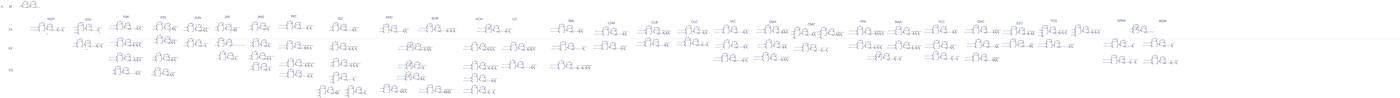
[diagram p0: schematic micro_instructions.asc, whole sheet]
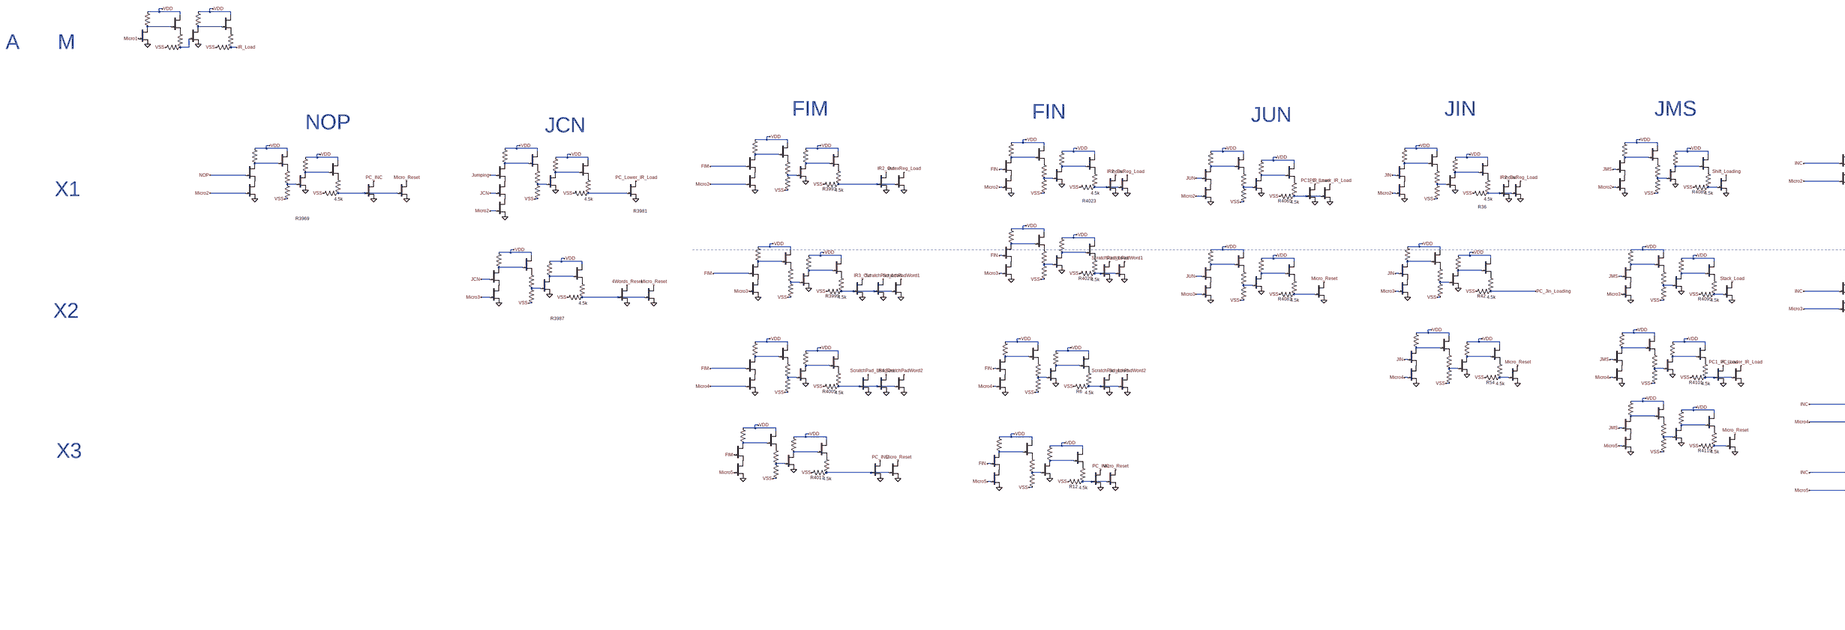
[diagram p1: schematic micro_instructions.asc, part, row 1 of 1, column 1 of 5]
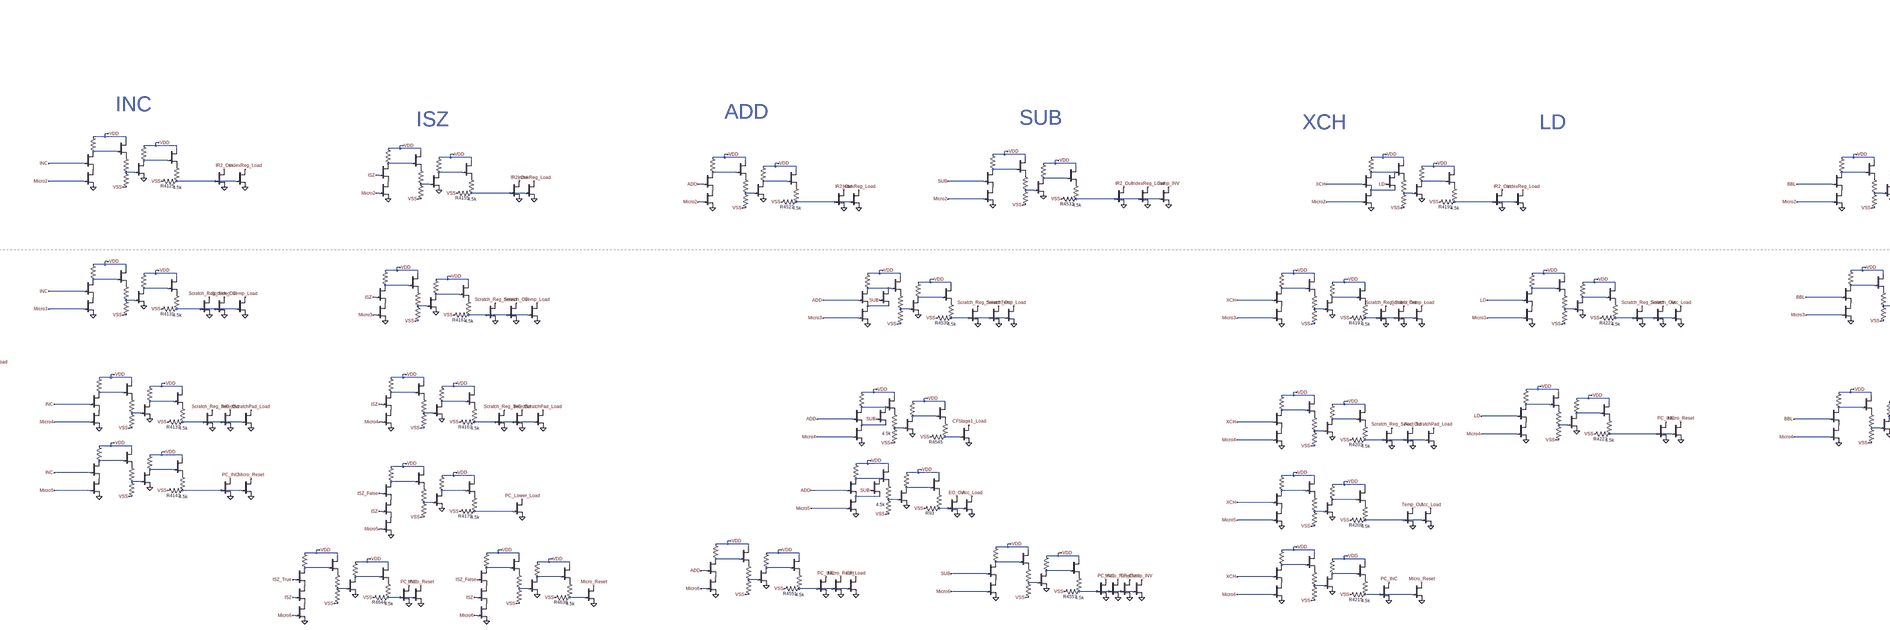
[diagram p2: schematic micro_instructions.asc, part, row 1 of 1, column 2 of 5]
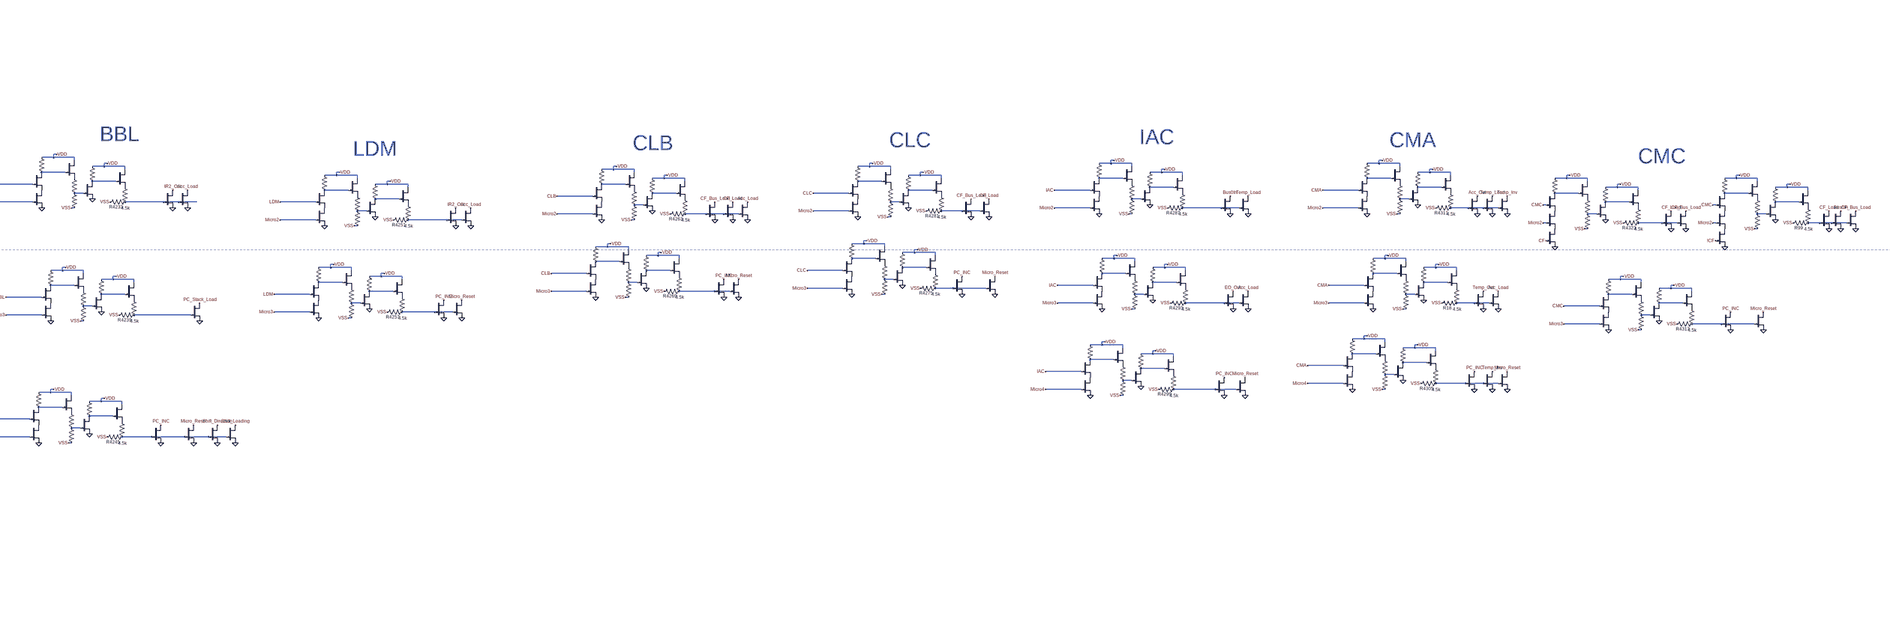
[diagram p3: schematic micro_instructions.asc, part, row 1 of 1, column 3 of 5]
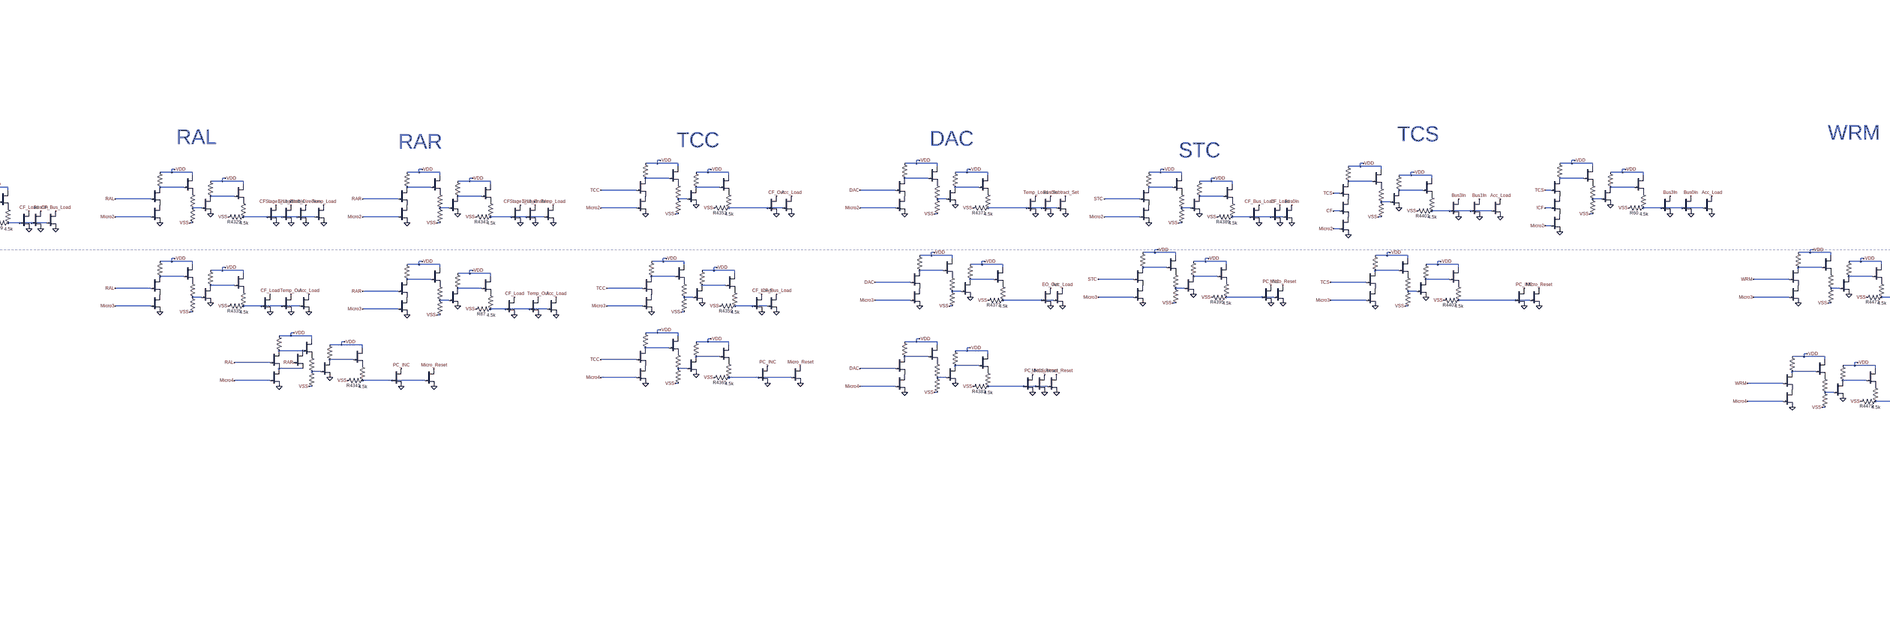
[diagram p4: schematic micro_instructions.asc, part, row 1 of 1, column 4 of 5]
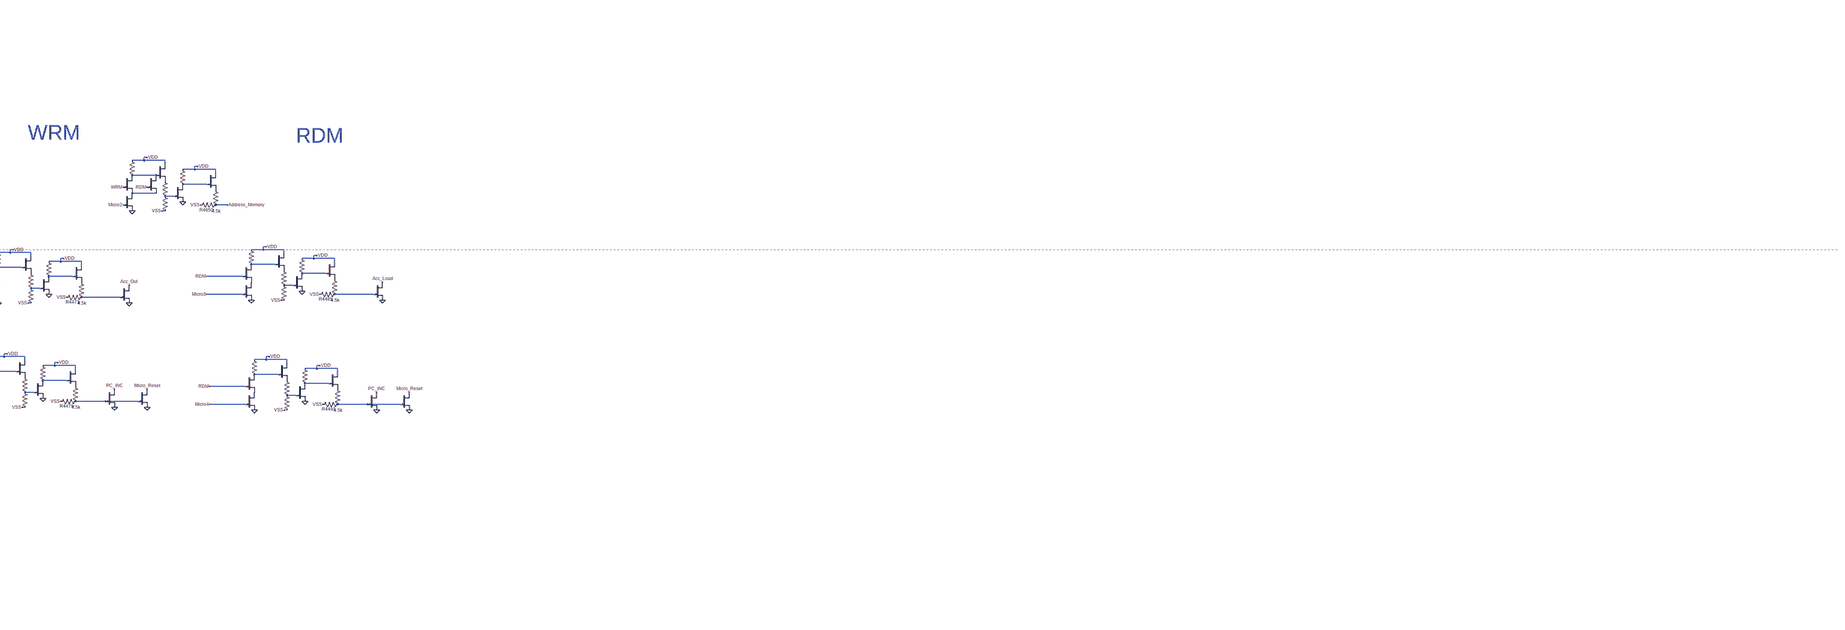
[diagram p5: schematic micro_instructions.asc, part, row 1 of 1, column 5 of 5]
* micro_instructions.asc
J_A2433 N009 NOP P001 DR
R3964 VDD N009 100k
J_F1003 VDD N009 P002 DR
R3965 P002 N043 1k
R3966 N043 VSS 4.8k
J_B1138 P001 Micro2 0 DR
J_A2434 N018 N043 0 DR
R3967 VDD N018 50k
J_F1004 VDD N018 P003 DR
R3968 P003 N066 1k
R3969 N066 VSS 4.5k
J_Input29 PC_INC N066 0 DR
J_Input30 Micro_Reset N066 0 DR
J_A2437 P004 JCN P005 DR
R3976 VDD N010 100k
J_F1007 VDD N010 P006 DR
R3977 P006 N044 1k
R3978 N044 VSS 4.8k
J_B1140 P005 Micro2 0 DR
J_A2438 N019 N044 0 DR
R3979 VDD N019 50k
J_F1008 VDD N019 P007 DR
R3980 P007 N067 1k
R3981 N067 VSS 4.5k
J_Input33 PC_Lower_IR_Load N067 0 DR
J_A2439 N127 JCN P008 DR
R3982 VDD N127 100k
J_F1009 VDD N127 P009 DR
R3983 P009 N165 1k
R3984 N165 VSS 4.8k
J_B1141 P008 Micro3 0 DR
J_A2440 N142 N165 0 DR
R3985 VDD N142 50k
J_F1010 VDD N142 P010 DR
R3986 P010 N187 1k
R3987 N187 VSS 4.5k
J_Input35 Micro_Reset N187 0 DR
J_A2441 N010 Jumping P004 DR
J_A2443 N005 FIM P011 DR
R3988 VDD N005 100k
J_F1011 VDD N005 P012 DR
R3989 P012 N026 1k
R3990 N026 VSS 4.8k
J_B1142 P011 Micro2 0 DR
J_A2444 N011 N026 0 DR
R3991 VDD N011 50k
J_F1012 VDD N011 P013 DR
R3992 P013 N045 1k
R3993 N045 VSS 4.5k
J_Input36 IR2_Out N045 0 DR
J_Input38 IndexReg_Load N045 0 DR
J_A2445 N120 FIM P014 DR
R3994 VDD N120 100k
J_F1013 VDD N120 P015 DR
R3995 P015 N152 1k
R3996 N152 VSS 4.8k
J_A2446 N131 N152 0 DR
R3997 VDD N131 50k
J_F1014 VDD N131 P016 DR
R3998 P016 N174 1k
R3999 N174 VSS 4.5k
J_Input39 IR3_Out N174 0 DR
J_Input40 ScratchPad_Load N174 0 DR
J_A2447 N226 FIM P017 DR
R4000 VDD N226 100k
J_F1015 VDD N226 P018 DR
R4001 P018 N247 1k
R4002 N247 VSS 4.8k
J_B1144 P017 Micro4 0 DR
J_A2448 N235 N247 0 DR
R4003 VDD N235 50k
J_F1016 VDD N235 P019 DR
R4004 P019 N258 1k
R4005 N258 VSS 4.5k
J_Input41 IR4_Out N258 0 DR
J_Input43 ScratchPad_Load N258 0 DR
J_A2451 N294 FIM P020 DR
R4012 VDD N294 100k
J_F1019 VDD N294 P021 DR
R4013 P021 N300 1k
R4014 N300 VSS 4.8k
J_B1146 P020 Micro5 0 DR
J_A2452 N296 N300 0 DR
R4015 VDD N296 50k
J_F1020 VDD N296 P022 DR
R4016 P022 N302 1k
R4017 N302 VSS 4.5k
J_Input46 PC_INC N302 0 DR
J_Input47 Micro_Reset N302 0 DR
J_Input49 IndexReg_Load N050 0 DR
J_A2453 N006 FIN P023 DR
R4018 VDD N006 100k
J_F1021 VDD N006 P024 DR
R4019 P024 N029 1k
R4020 N029 VSS 4.8k
J_A2454 N014 N029 0 DR
R4021 VDD N014 50k
J_F1022 VDD N014 P025 DR
R4022 P025 N050 1k
R4023 N050 VSS 4.5k
J_Input50 IR2_Out N050 0 DR
J_A2455 N117 FIN P026 DR
R4024 VDD N117 100k
J_F1023 VDD N117 P027 DR
R4025 P027 N123 1k
R4026 N123 VSS 4.8k
J_A2456 N118 N123 0 DR
R4027 VDD N118 50k
J_F1024 VDD N118 P028 DR
R4028 P028 N136 1k
R4029 N136 VSS 4.5k
J_Input59 PC_INC N305 0 DR
J_Input60 Micro_Reset N305 0 DR
J_A2467 N015 JUN P029 DR
R4060 VDD N015 100k
J_F1035 VDD N015 P030 DR
R4061 P030 N051 1k
R4062 N051 VSS 4.8k
J_A2468 N027 N051 0 DR
R4063 VDD N027 50k
J_F1036 VDD N027 P031 DR
R4064 P031 N077 1k
R4065 N077 VSS 4.5k
J_Input72 PC_Lower_IR_Load N077 0 DR
J_Input74 PC1_IR_Load N077 0 DR
J_A2473 N124 JUN P032 DR
R4078 VDD N124 100k
J_F1041 VDD N124 P033 DR
R4079 P033 N158 1k
R4080 N158 VSS 4.8k
J_B1157 P032 Micro3 0 DR
J_A2474 N137 N158 0 DR
R4081 VDD N137 50k
J_F1042 VDD N137 P034 DR
R4082 P034 N179 1k
R4083 N179 VSS 4.5k
J_Input78 Micro_Reset N179 0 DR
J_A2475 N007 JMS P035 DR
R4084 VDD N007 100k
J_F1043 VDD N007 P036 DR
R4085 P036 N030 1k
R4086 N030 VSS 4.8k
J_A2476 N016 N030 0 DR
R4087 VDD N016 50k
J_F1044 VDD N016 P037 DR
R4088 P037 N052 1k
R4089 N052 VSS 4.5k
J_Input94 Shift_Loading N052 0 DR
J_A2477 N125 JMS P038 DR
R4090 VDD N125 100k
J_F1045 VDD N125 P039 DR
R4091 P039 N159 1k
R4092 N159 VSS 4.8k
J_A2478 N138 N159 0 DR
R4093 VDD N138 50k
J_F1046 VDD N138 P040 DR
R4094 P040 N180 1k
R4095 N180 VSS 4.5k
J_Input95 Stack_Load N180 0 DR
J_A2479 N222 JMS P041 DR
R4096 VDD N222 100k
J_F1047 VDD N222 P042 DR
R4097 P042 N239 1k
R4098 N239 VSS 4.8k
J_B1160 P041 Micro4 0 DR
J_A2480 N229 N239 0 DR
R4099 VDD N229 50k
J_F1048 VDD N229 P043 DR
R4100 P043 N250 1k
R4101 N250 VSS 4.5k
J_Input96 PC1_IR_Load N250 0 DR
J_Input97 PC_Lower_IR_Load N250 0 DR
J_A2485 N277 JMS P044 DR
R4114 VDD N277 100k
J_F1053 VDD N277 P045 DR
R4115 P045 N290 1k
R4116 N290 VSS 4.8k
J_B1163 P044 Micro5 0 DR
J_A2486 N283 N290 0 DR
R4117 VDD N283 50k
J_F1054 VDD N283 P046 DR
R4118 P046 N295 1k
R4119 N295 VSS 4.5k
J_Input103 Micro_Reset N295 0 DR
J_A2487 N004 INC P047 DR
R4120 VDD N004 100k
J_F1055 VDD N004 P048 DR
R4121 P048 N021 1k
R4122 N021 VSS 4.8k
J_B1164 P047 Micro2 0 DR
J_A2488 N008 N021 0 DR
R4123 VDD N008 50k
J_F1056 VDD N008 P049 DR
R4124 P049 N037 1k
R4125 N037 VSS 4.5k
J_Input104 IR2_Out N037 0 DR
J_Input105 IndexReg_Load N037 0 DR
J_A2489 N147 INC P050 DR
R4126 VDD N147 100k
J_F1057 VDD N147 P051 DR
R4127 P051 N195 1k
R4128 N195 VSS 4.8k
J_B1165 P050 Micro3 0 DR
J_A2490 N166 N195 0 DR
R4129 VDD N166 50k
J_F1058 VDD N166 P052 DR
R4130 P052 N208 1k
R4131 N208 VSS 4.5k
J_Input106 Scratch_Out N208 0 DR
J_Input107 ScratchPad_Load N281 0 DR
J_A2491 N262 INC P053 DR
R4132 VDD N262 100k
J_F1059 VDD N262 P054 DR
R4133 P054 N274 1k
R4134 N274 VSS 4.8k
J_B1166 P053 Micro4 0 DR
J_A2492 N266 N274 0 DR
R4135 VDD N266 50k
J_F1060 VDD N266 P055 DR
R4136 P055 N281 1k
R4137 N281 VSS 4.5k
J_Input108 INC_Out N281 0 DR
J_Input109 Temp_Load N208 0 DR
J_A2493 N299 INC P056 DR
R4138 VDD N299 100k
J_F1061 VDD N299 P057 DR
R4139 P057 N306 1k
R4140 N306 VSS 4.8k
J_B1167 P056 Micro5 0 DR
J_A2494 N301 N306 0 DR
R4141 VDD N301 50k
J_F1062 VDD N301 P058 DR
R4142 P058 N309 1k
R4143 N309 VSS 4.5k
J_Input112 PC_INC N309 0 DR
J_Input113 Micro_Reset N309 0 DR
J_A2497 N013 ISZ P059 DR
R4150 VDD N013 100k
J_F1065 VDD N013 P060 DR
R4151 P060 N047 1k
R4152 N047 VSS 4.8k
J_A2498 N022 N047 0 DR
R4153 VDD N022 50k
J_F1066 VDD N022 P061 DR
R4154 P061 N069 1k
R4155 N069 VSS 4.5k
J_Input114 IR2_Out N069 0 DR
J_Input115 IndexReg_Load N069 0 DR
J_A2499 N160 ISZ P062 DR
R4156 VDD N160 100k
J_F1067 VDD N160 P063 DR
R4157 P063 N203 1k
R4158 N203 VSS 4.8k
J_A2500 N181 N203 0 DR
R4159 VDD N181 50k
J_F1068 VDD N181 P064 DR
R4160 P064 N214 1k
R4161 N214 VSS 4.5k
J_Input116 Scratch_Out N214 0 DR
J_A2501 N263 ISZ P065 DR
R4162 VDD N263 100k
J_F1069 VDD N263 P066 DR
R4163 P066 N275 1k
R4164 N275 VSS 4.8k
J_B1171 P065 Micro4 0 DR
J_A2502 N267 N275 0 DR
R4165 VDD N267 50k
J_F1070 VDD N267 P067 DR
R4166 P067 N282 1k
R4167 N282 VSS 4.5k
J_Input119 Temp_Load N214 0 DR
J_Input122 PC_INC N338 0 DR
J_Input123 Micro_Reset N338 0 DR
J_A2505 P068 ISZ P069 DR
R4174 VDD N307 100k
J_F1073 VDD N307 P070 DR
R4175 P070 N315 1k
R4176 N315 VSS 4.8k
J_B1173 P069 Micro5 0 DR
J_A2506 N310 N315 0 DR
R4177 VDD N310 50k
J_F1074 VDD N310 P071 DR
R4178 P071 N317 1k
R4179 N317 VSS 4.5k
J_Input125 PC_Lower_Load N317 0 DR
J_A2509 N307 ISZ_False P068 DR
J_A2511 N024 XCH N062 DR
R4186 VDD N024 100k
J_F1077 VDD N024 P072 DR
R4187 P072 N071 1k
R4188 N071 VSS 4.8k
J_B1175 N062 Micro2 0 DR
J_A2512 N039 N071 0 DR
R4189 VDD N039 50k
J_F1078 VDD N039 P073 DR
R4190 P073 N090 1k
R4191 N090 VSS 4.5k
J_Input128 IR2_Out N090 0 DR
J_Input129 IndexReg_Load N090 0 DR
J_A2513 N168 XCH P074 DR
R4192 VDD N168 100k
J_F1079 VDD N168 P075 DR
R4193 P075 N210 1k
R4194 N210 VSS 4.8k
J_B1176 P074 Micro3 0 DR
J_A2514 N189 N210 0 DR
R4195 VDD N189 50k
J_F1080 VDD N189 P076 DR
R4196 P076 N218 1k
R4197 N218 VSS 4.5k
J_Input130 Scratch_Out N218 0 DR
J_Input131 Temp_Load N218 0 DR
J_A2515 N273 XCH P077 DR
R4198 VDD N273 100k
J_F1081 VDD N273 P078 DR
R4199 P078 N288 1k
R4200 N288 VSS 4.8k
J_B1177 P077 Micro4 0 DR
J_A2516 N280 N288 0 DR
R4201 VDD N280 50k
J_F1082 VDD N280 P079 DR
R4202 P079 N293 1k
R4203 N293 VSS 4.5k
J_Input132 Acc_Out N293 0 DR
J_Input133 ScratchPad_Load N293 0 DR
J_A2517 N311 XCH P080 DR
R4204 VDD N311 100k
J_F1083 VDD N311 P081 DR
R4205 P081 N318 1k
R4206 N318 VSS 4.8k
J_B1178 P080 Micro5 0 DR
J_A2518 N314 N318 0 DR
R4207 VDD N314 50k
J_F1084 VDD N314 P082 DR
R4208 P082 N319 1k
R4209 N319 VSS 4.5k
J_Input134 Temp_Out N319 0 DR
J_Input135 Acc_Load N319 0 DR
J_A2519 N322 XCH P083 DR
R4210 VDD N322 100k
J_F1085 VDD N322 P084 DR
R4211 P084 N332 1k
R4212 N332 VSS 4.8k
J_B1179 P083 Micro6 0 DR
J_A2520 N327 N332 0 DR
R4213 VDD N327 50k
J_F1086 VDD N327 P085 DR
R4214 P085 N337 1k
R4215 N337 VSS 4.5k
J_Input136 PC_INC N337 0 DR
J_Input137 Micro_Reset N337 0 DR
J_A2521 N169 LD P086 DR
R4216 VDD N169 100k
J_F1087 VDD N169 P087 DR
R4217 P087 N211 1k
R4218 N211 VSS 4.8k
J_B1180 P086 Micro3 0 DR
J_A2522 N190 N211 0 DR
R4219 VDD N190 50k
J_F1088 VDD N190 P088 DR
R4220 P088 N219 1k
R4221 N219 VSS 4.5k
J_Input138 Scratch_Out N219 0 DR
J_Input139 Acc_Load N219 0 DR
J_A2523 N024 LD N062 DR
J_A2524 N269 LD P089 DR
R4222 VDD N269 100k
J_F1089 VDD N269 P090 DR
R4223 P090 N285 1k
R4224 N285 VSS 4.8k
J_B1181 P089 Micro4 0 DR
J_A2525 N276 N285 0 DR
R4225 VDD N276 50k
J_F1090 VDD N276 P091 DR
R4226 P091 N289 1k
R4227 N289 VSS 4.5k
J_Input140 PC_INC N289 0 DR
J_Input141 Micro_Reset N289 0 DR
J_A2526 N025 BBL P092 DR
R4228 VDD N025 100k
J_F1091 VDD N025 P093 DR
R4229 P093 N072 1k
R4230 N072 VSS 4.8k
J_B1182 P092 Micro2 0 DR
J_A2527 N040 N072 0 DR
R4231 VDD N040 50k
J_F1092 VDD N040 P094 DR
R4232 P094 N091 1k
R4233 N091 VSS 4.5k
J_Input142 IR2_Out N091 0 DR
J_Input143 Acc_Load N091 0 DR
J_Input144 Shift_Direction N292 0 DR
J_Input145 Shift_Loading N292 0 DR
J_A2528 N161 BBL P095 DR
R4234 VDD N161 100k
J_F1093 VDD N161 P096 DR
R4235 P096 N205 1k
R4236 N205 VSS 4.8k
J_B1183 P095 Micro3 0 DR
J_A2529 N182 N205 0 DR
R4237 VDD N182 50k
J_F1094 VDD N182 P097 DR
R4238 P097 N215 1k
R4239 N215 VSS 4.5k
J_Input146 PC_Stack_Load N215 0 DR
J_A2530 N272 BBL P098 DR
R4240 VDD N272 100k
J_F1095 VDD N272 P099 DR
R4241 P099 N287 1k
R4242 N287 VSS 4.8k
J_B1184 P098 Micro4 0 DR
J_A2531 N279 N287 0 DR
R4243 VDD N279 50k
J_F1096 VDD N279 P100 DR
R4244 P100 N292 1k
R4245 N292 VSS 4.5k
J_Input147 PC_INC N292 0 DR
J_Input148 Micro_Reset N292 0 DR
J_A2532 N063 LDM P101 DR
R4246 VDD N063 100k
J_F1097 VDD N063 P102 DR
R4247 P102 N105 1k
R4248 N105 VSS 4.8k
J_B1185 P101 Micro2 0 DR
J_A2533 N083 N105 0 DR
R4249 VDD N083 50k
J_F1098 VDD N083 P103 DR
R4250 P103 N114 1k
R4251 N114 VSS 4.5k
J_Input149 IR2_Out N114 0 DR
J_Input150 Acc_Load N114 0 DR
J_A2534 N154 LDM P104 DR
R4252 VDD N154 100k
J_F1099 VDD N154 P105 DR
R4253 P105 N199 1k
R4254 N199 VSS 4.8k
J_B1186 P104 Micro3 0 DR
J_A2535 N175 N199 0 DR
R4255 VDD N175 50k
J_F1100 VDD N175 P106 DR
R4256 P106 N213 1k
R4257 N213 VSS 4.5k
J_Input151 PC_INC N213 0 DR
J_Input152 Micro_Reset N213 0 DR
J_Input153 Acc_Load N108 0 DR
J_A2536 N048 CLB P107 DR
R4258 VDD N048 100k
J_F1101 VDD N048 P108 DR
R4259 P108 N096 1k
R4260 N096 VSS 4.8k
J_B1187 P107 Micro2 0 DR
J_A2537 N073 N096 0 DR
R4261 VDD N073 50k
J_F1102 VDD N073 P109 DR
R4262 P109 N108 1k
R4263 N108 VSS 4.5k
J_Input154 CF_Load N108 0 DR
J_A2538 N122 CLB P110 DR
R4264 VDD N122 100k
J_F1103 VDD N122 P111 DR
R4265 P111 N155 1k
R4266 N155 VSS 4.8k
J_B1188 P110 Micro3 0 DR
J_A2539 N133 N155 0 DR
R4267 VDD N133 50k
J_F1104 VDD N133 P112 DR
R4268 P112 N176 1k
R4269 N176 VSS 4.5k
J_Input155 PC_INC N176 0 DR
J_Input156 Micro_Reset N176 0 DR
J_A2540 N119 CLC P113 DR
R4270 VDD N119 100k
J_F1105 VDD N119 P114 DR
R4271 P114 N148 1k
R4272 N148 VSS 4.8k
J_B1189 P113 Micro3 0 DR
J_A2541 N128 N148 0 DR
R4273 VDD N128 50k
J_F1106 VDD N128 P115 DR
R4274 P115 N170 1k
R4275 N170 VSS 4.5k
J_Input157 PC_INC N170 0 DR
J_Input158 Micro_Reset N170 0 DR
J_A2542 N041 CLC P116 DR
R4276 VDD N041 100k
J_F1107 VDD N041 P117 DR
R4277 P117 N092 1k
R4278 N092 VSS 4.8k
J_B1190 P116 Micro2 0 DR
J_A2543 N064 N092 0 DR
R4279 VDD N064 50k
J_F1108 VDD N064 P118 DR
R4280 P118 N106 1k
R4281 N106 VSS 4.5k
J_Input160 Temp_Load N097 0 DR
J_A2544 N032 IAC P119 DR
R4282 VDD N032 100k
J_F1109 VDD N032 P120 DR
R4283 P120 N084 1k
R4284 N084 VSS 4.8k
J_B1191 P119 Micro2 0 DR
J_A2545 N053 N084 0 DR
R4285 VDD N053 50k
J_F1110 VDD N053 P121 DR
R4286 P121 N097 1k
R4287 N097 VSS 4.5k
J_Input161 Bus0In N097 0 DR
J_A2546 N139 IAC P122 DR
R4288 VDD N139 100k
J_F1111 VDD N139 P123 DR
R4289 P123 N183 1k
R4290 N183 VSS 4.8k
J_B1192 P122 Micro3 0 DR
J_A2547 N156 N183 0 DR
R4291 VDD N156 50k
J_F1112 VDD N156 P124 DR
R4292 P124 N200 1k
R4293 N200 VSS 4.5k
J_Input162 EO_Out N200 0 DR
J_Input163 Acc_Load N200 0 DR
J_A2548 N232 IAC P125 DR
R4294 VDD N232 100k
J_F1113 VDD N232 P126 DR
R4295 P126 N253 1k
R4296 N253 VSS 4.8k
J_B1193 P125 Micro4 0 DR
J_A2549 N240 N253 0 DR
R4297 VDD N240 50k
J_F1114 VDD N240 P127 DR
R4298 P127 N261 1k
R4299 N261 VSS 4.5k
J_Input164 PC_INC N261 0 DR
J_Input165 Micro_Reset N261 0 DR
J_A2550 N225 CMA P128 DR
R4300 VDD N225 100k
J_F1115 VDD N225 P129 DR
R4301 P129 N245 1k
R4302 N245 VSS 4.8k
J_B1194 P128 Micro4 0 DR
J_A2551 N234 N245 0 DR
R4303 VDD N234 50k
J_F1116 VDD N234 P130 DR
R4304 P130 N256 1k
R4305 N256 VSS 4.5k
J_Input166 PC_INC N256 0 DR
J_Input167 Micro_Reset N256 0 DR
J_A2552 N033 CMA P131 DR
R4306 VDD N033 100k
J_F1117 VDD N033 P132 DR
R4307 P132 N085 1k
R4308 N085 VSS 4.8k
J_B1195 P131 Micro2 0 DR
J_A2553 N054 N085 0 DR
R4309 VDD N054 50k
J_F1118 VDD N054 P133 DR
R4310 P133 N098 1k
R4311 N098 VSS 4.5k
J_Input168 Acc_Out N098 0 DR
J_A2554 N185 CMC P134 DR
R4312 VDD N185 100k
J_F1119 VDD N185 P135 DR
R4313 P135 N216 1k
R4314 N216 VSS 4.8k
J_B1196 P134 Micro3 0 DR
J_A2555 N202 N216 0 DR
R4315 VDD N202 50k
J_F1120 VDD N202 P136 DR
R4316 P136 N220 1k
R4317 N220 VSS 4.5k
J_Input169 PC_INC N220 0 DR
J_Input170 Micro_Reset N220 0 DR
J_A2556 N074 CMC P137 DR
R4318 VDD N074 100k
J_F1121 VDD N074 P138 DR
R4319 P138 N109 1k
R4320 N109 VSS 4.8k
J_B1197 P137 Micro2 P139 DR
J_A2557 N093 N109 0 DR
R4321 VDD N093 50k
J_F1122 VDD N093 P140 DR
R4322 P140 N115 1k
R4323 N115 VSS 4.5k
J_Input171 CF_Bus_Load N115 0 DR
J_A2558 N055 RAL P141 DR
R4324 VDD N055 100k
J_F1123 VDD N055 P142 DR
R4325 P142 N099 1k
R4326 N099 VSS 4.8k
J_B1198 P141 Micro2 0 DR
J_A2559 N078 N099 0 DR
R4327 VDD N078 50k
J_F1124 VDD N078 P143 DR
R4328 P143 N111 1k
R4329 N111 VSS 4.5k
J_Input172 Shift_Enable N111 0 DR
J_Input173 Temp_Load N111 0 DR
J_Input174 Shift_Direction N111 0 DR
J_A2560 N143 RAL P144 DR
R4330 VDD N143 100k
J_F1125 VDD N143 P145 DR
R4331 P145 N191 1k
R4332 N191 VSS 4.8k
J_B1199 P144 Micro3 0 DR
J_A2561 N162 N191 0 DR
R4333 VDD N162 50k
J_F1126 VDD N162 P146 DR
R4334 P146 N206 1k
R4335 N206 VSS 4.5k
J_Input175 Temp_Out N206 0 DR
J_Input176 Acc_Load N206 0 DR
J_A2562 N224 RAL N241 DR
R4336 VDD N224 100k
J_F1127 VDD N224 P147 DR
R4337 P147 N243 1k
R4338 N243 VSS 4.8k
J_B1200 N241 Micro4 0 DR
J_A2563 N233 N243 0 DR
R4339 VDD N233 50k
J_F1128 VDD N233 P148 DR
R4340 P148 N254 1k
R4341 N254 VSS 4.5k
J_Input177 PC_INC N254 0 DR
J_Input178 Micro_Reset N254 0 DR
J_A2564 N056 RAR P149 DR
R4342 VDD N056 100k
J_F1129 VDD N056 P150 DR
R4343 P150 N100 1k
R4344 N100 VSS 4.8k
J_B1201 P149 Micro2 0 DR
J_A2565 N079 N100 0 DR
R4345 VDD N079 50k
J_F1130 VDD N079 P151 DR
R4346 P151 N112 1k
R4347 N112 VSS 4.5k
J_A2567 N224 RAR N241 DR
J_A2568 N034 TCC P152 DR
R4348 VDD N034 100k
J_F1131 VDD N034 P153 DR
R4349 P153 N086 1k
R4350 N086 VSS 4.8k
J_B1202 P152 Micro2 0 DR
J_A2569 N057 N086 0 DR
R4351 VDD N057 50k
J_F1132 VDD N057 P154 DR
R4352 P154 N101 1k
R4353 N101 VSS 4.5k
J_Input181 CF_Out N101 0 DR
J_Input182 Acc_Load N101 0 DR
J_A2570 N144 TCC P155 DR
R4354 VDD N144 100k
J_F1133 VDD N144 P156 DR
R4355 P156 N192 1k
R4356 N192 VSS 4.8k
J_B1203 P155 Micro3 0 DR
J_A2571 N163 N192 0 DR
R4357 VDD N163 50k
J_F1134 VDD N163 P157 DR
R4358 P157 N207 1k
R4359 N207 VSS 4.5k
J_A2572 N223 TCC P158 DR
R4360 VDD N223 100k
J_F1135 VDD N223 P159 DR
R4361 P159 N242 1k
R4362 N242 VSS 4.8k
J_B1204 P158 Micro4 0 DR
J_A2573 N230 N242 0 DR
R4363 VDD N230 50k
J_F1136 VDD N230 P160 DR
R4364 P160 N251 1k
R4365 N251 VSS 4.5k
J_Input184 PC_INC N251 0 DR
J_Input185 Micro_Reset N251 0 DR
J_A2574 N035 DAC P161 DR
R4366 VDD N035 100k
J_F1137 VDD N035 P162 DR
R4367 P162 N087 1k
R4368 N087 VSS 4.8k
J_B1205 P161 Micro2 0 DR
J_A2575 N058 N087 0 DR
R4369 VDD N058 50k
J_F1138 VDD N058 P163 DR
R4370 P163 N102 1k
R4371 N102 VSS 4.5k
J_Input186 Bus0In N102 0 DR
J_Input187 Temp_Load N102 0 DR
J_Input188 Subtract_Set N102 0 DR
J_A2576 N134 DAC P164 DR
R4372 VDD N134 100k
J_F1139 VDD N134 P165 DR
R4373 P165 N177 1k
R4374 N177 VSS 4.8k
J_B1206 P164 Micro3 0 DR
J_A2577 N150 N177 0 DR
R4375 VDD N150 50k
J_F1140 VDD N150 P166 DR
R4376 P166 N197 1k
R4377 N197 VSS 4.5k
J_Input189 EO_Out N197 0 DR
J_Input190 Subtract_Reset N260 0 DR
J_Input191 Acc_Load N197 0 DR
J_A2578 N231 DAC P167 DR
R4378 VDD N231 100k
J_F1141 VDD N231 P168 DR
R4379 P168 N252 1k
R4380 N252 VSS 4.8k
J_B1207 P167 Micro4 0 DR
J_A2579 N237 N252 0 DR
R4381 VDD N237 50k
J_F1142 VDD N237 P169 DR
R4382 P169 N260 1k
R4383 N260 VSS 4.5k
J_Input192 PC_INC N260 0 DR
J_Input193 Micro_Reset N260 0 DR
J_Input194 Bus0In N113 0 DR
J_A2580 N059 STC P170 DR
R4384 VDD N059 100k
J_F1143 VDD N059 P171 DR
R4385 P171 N103 1k
R4386 N103 VSS 4.8k
J_B1208 P170 Micro2 0 DR
J_A2581 N080 N103 0 DR
R4387 VDD N080 50k
J_F1144 VDD N080 P172 DR
R4388 P172 N113 1k
R4389 N113 VSS 4.5k
J_Input195 CF_Load N113 0 DR
J_A2582 N129 STC P173 DR
R4390 VDD N129 100k
J_F1145 VDD N129 P174 DR
R4391 P174 N172 1k
R4392 N172 VSS 4.8k
J_B1209 P173 Micro3 0 DR
J_A2583 N145 N172 0 DR
R4393 VDD N145 50k
J_F1146 VDD N145 P175 DR
R4394 P175 N193 1k
R4395 N193 VSS 4.5k
J_Input196 PC_INC N193 0 DR
J_Input197 Micro_Reset N193 0 DR
J_A2584 N042 TCS P176 DR
R4396 VDD N042 100k
J_F1147 VDD N042 P177 DR
R4397 P177 N095 1k
R4398 N095 VSS 4.8k
J_B1210 P178 Micro2 0 DR
J_A2585 N065 N095 0 DR
R4399 VDD N065 50k
J_F1148 VDD N065 P179 DR
R4400 P179 N107 1k
R4401 N107 VSS 4.5k
J_Input198 Bus3In N107 0 DR
J_A2586 N135 TCS P180 DR
R4402 VDD N135 100k
J_F1149 VDD N135 P181 DR
R4403 P181 N178 1k
R4404 N178 VSS 4.8k
J_B1211 P180 Micro3 0 DR
J_A2587 N151 N178 0 DR
R4405 VDD N151 50k
J_F1150 VDD N151 P182 DR
R4406 P182 N198 1k
R4407 N198 VSS 4.5k
J_Input200 Acc_Load N107 0 DR
J_Input201 PC_INC N198 0 DR
J_Input202 Micro_Reset N198 0 DR
J_A2612 N130 WRM P183 DR
R4468 VDD N130 100k
J_F1171 VDD N130 P184 DR
R4469 P184 N173 1k
R4470 N173 VSS 4.8k
J_B1222 P183 Micro3 0 DR
J_A2613 N146 N173 0 DR
R4471 VDD N146 50k
J_F1172 VDD N146 P185 DR
R4472 P185 N194 1k
R4473 N194 VSS 4.5k
J_Input228 Acc_Out N194 0 DR
J_A2614 N244 WRM P186 DR
R4474 VDD N244 100k
J_F1173 VDD N244 P187 DR
R4475 P187 N264 1k
R4476 N264 VSS 4.8k
J_B1223 P186 Micro4 0 DR
J_A2615 N255 N264 0 DR
R4477 VDD N255 50k
J_F1174 VDD N255 P188 DR
R4478 P188 N268 1k
R4479 N268 VSS 4.5k
J_Input230 PC_INC N268 0 DR
J_Input231 Micro_Reset N268 0 DR
J_A2616 N126 RDM P189 DR
R4480 VDD N126 100k
J_F1175 VDD N126 P190 DR
R4481 P190 N164 1k
R4482 N164 VSS 4.8k
J_B1224 P189 Micro3 0 DR
J_A2617 N141 N164 0 DR
R4483 VDD N141 50k
J_F1176 VDD N141 P191 DR
R4484 P191 N186 1k
R4485 N186 VSS 4.5k
J_Input232 Acc_Load N186 0 DR
J_A2618 N246 RDM P192 DR
R4486 VDD N246 100k
J_F1177 VDD N246 P193 DR
R4487 P193 N265 1k
R4488 N265 VSS 4.8k
J_B1225 P192 Micro4 0 DR
J_A2619 N257 N265 0 DR
R4489 VDD N257 50k
J_F1178 VDD N257 P194 DR
R4490 P194 N270 1k
R4491 N270 VSS 4.5k
J_Input234 PC_INC N270 0 DR
J_Input235 Micro_Reset N270 0 DR
J_A2631 N023 ADD P195 DR
R4522 VDD N023 100k
J_F1189 VDD N023 P196 DR
R4523 P196 N070 1k
R4524 N070 VSS 4.8k
J_B1231 P195 Micro2 0 DR
J_A2632 N038 N070 0 DR
R4525 VDD N038 50k
J_F1190 VDD N038 P197 DR
R4526 P197 N089 1k
R4527 N089 VSS 4.5k
J_A2633 N017 SUB P198 DR
R4528 VDD N017 100k
J_F1191 VDD N017 P199 DR
R4529 P199 N061 1k
R4530 N061 VSS 4.8k
J_B1232 P198 Micro2 0 DR
J_A2634 N031 N061 0 DR
R4531 VDD N031 50k
J_F1192 VDD N031 P200 DR
R4532 P200 N082 1k
R4533 N082 VSS 4.5k
J_Input248 IR2_Out N089 0 DR
J_Input249 IR2_Out N082 0 DR
J_Input250 IndexReg_Load N089 0 DR
J_Input251 IndexReg_Load N082 0 DR
J_A2635 N167 ADD N204 DR
R4534 VDD N167 100k
J_F1193 VDD N167 P201 DR
R4535 P201 N209 1k
R4536 N209 VSS 4.8k
J_B1233 N204 Micro3 0 DR
J_A2636 N188 N209 0 DR
R4537 VDD N188 50k
J_F1194 VDD N188 P202 DR
R4538 P202 N217 1k
R4539 N217 VSS 4.5k
J_Input252 Scratch_Out N217 0 DR
J_Input253 Temp_Load N217 0 DR
J_A2637 N271 ADD N284 DR
R4540 VDD N271 100k
J_F1195 VDD N271 P203 DR
R4541 P203 N286 1k
R4542 N286 VSS 4.8k
J_B1234 N284 Micro4 0 DR
J_A2638 N278 N286 0 DR
R4543 VDD N278 50k
J_F1196 VDD N278 P204 DR
R4544 P204 N291 1k
R4545 N291 VSS 4.5k
J_Input254 EO_Out N316 0 DR
J_Input255 Acc_Load N316 0 DR
J_A2639 N320 ADD P205 DR
R4546 VDD N320 100k
J_F1197 VDD N320 P206 DR
R4547 P206 N330 1k
R4548 N330 VSS 4.8k
J_B1235 P205 Micro6 0 DR
J_A2640 N325 N330 0 DR
R4549 VDD N325 50k
J_F1198 VDD N325 P207 DR
R4550 P207 N335 1k
R4551 N335 VSS 4.5k
J_Input256 PC_INC N335 0 DR
J_Input257 Micro_Reset N335 0 DR
J_Input258 Temp_INV N082 0 DR
J_A2641 N167 SUB N204 DR
J_Input259 CF_Load N335 0 DR
J_A2643 N271 SUB N284 DR
J_A2644 N321 SUB P208 DR
R4552 VDD N321 100k
J_F1199 VDD N321 P209 DR
R4553 P209 N331 1k
R4554 N331 VSS 4.8k
J_B1236 P208 Micro6 0 DR
J_A2645 N326 N331 0 DR
R4555 VDD N326 50k
J_F1200 VDD N326 P210 DR
R4556 P210 N336 1k
R4557 N336 VSS 4.5k
J_Input261 PC_INC N336 0 DR
J_Input262 Micro_Reset N336 0 DR
J_Input263 CF_Load N336 0 DR
J_Input265 Temp_INV N336 0 DR
J_A2672 N324 ISZ_False P211 DR
R4633 VDD N324 100k
J_F1224 VDD N324 P212 DR
R4634 P212 N334 1k
R4635 N334 VSS 4.8k
J_B1250 P211 ISZ P213 DR
J_A2673 N329 N334 0 DR
R4636 VDD N329 50k
J_F1225 VDD N329 P214 DR
R4637 P214 N339 1k
R4638 N339 VSS 4.5k
J_A2674 P213 Micro6 0 DR
J_A2675 N323 ISZ_True P215 DR
R4639 VDD N323 100k
J_F1226 VDD N323 P216 DR
R4640 P216 N333 1k
R4641 N333 VSS 4.8k
J_B1251 P215 ISZ P217 DR
J_A2676 N328 N333 0 DR
R4642 VDD N328 50k
J_F1227 VDD N328 P218 DR
R4643 P218 N338 1k
R4644 N338 VSS 4.5k
J_A2677 P217 Micro6 0 DR
J_Input77 Micro_Reset N339 0 DR
J_A2678 N028 WRM N076 DR
R4645 VDD N028 100k
J_F1228 VDD N028 P219 DR
R4646 P219 N081 1k
R4647 N081 VSS 4.8k
J_B1252 N076 Micro2 0 DR
J_A2679 N049 N081 0 DR
R4648 VDD N049 50k
J_F1229 VDD N049 P220 DR
R4649 P220 Address_Memory 1k
R4650 Address_Memory VSS 4.5k
J_A2682 N028 RDM N076 DR
J_Input12 4Words_Reset N187 0 DR
J_B4 P023 Micro2 0 DR
J_B5 P026 Micro3 0 DR
J_A1 N227 FIN P221 DR
R1 VDD N227 100k
J_F1 VDD N227 P222 DR
R2 P222 N248 1k
R3 N248 VSS 4.8k
J_A2 N236 N248 0 DR
R4 VDD N236 50k
J_F2 VDD N236 P223 DR
R5 P223 N259 1k
R6 N259 VSS 4.5k
J_B7 P221 Micro4 0 DR
J_A3 N297 FIN P224 DR
R7 VDD N297 100k
J_F3 VDD N297 P225 DR
R8 P225 N303 1k
R9 N303 VSS 4.8k
J_B8 P224 Micro5 0 DR
J_A4 N298 N303 0 DR
R10 VDD N298 50k
J_F4 VDD N298 P226 DR
R11 P226 N305 1k
R12 N305 VSS 4.5k
J_B16 P029 Micro2 0 DR
J_Input55 IndexReg_Load N068 0 DR
J_A11 N012 JIN P227 DR
R31 VDD N012 100k
J_F11 VDD N012 P228 DR
R32 P228 N046 1k
R33 N046 VSS 4.8k
J_B9 P227 Micro2 0 DR
J_A12 N020 N046 0 DR
R34 VDD N020 50k
J_F12 VDD N020 P229 DR
R35 P229 N068 1k
R36 N068 VSS 4.5k
J_Input56 IR2_Out N068 0 DR
J_A13 N121 JIN P230 DR
R37 VDD N121 100k
J_F13 VDD N121 P231 DR
R38 P231 N153 1k
R39 N153 VSS 4.8k
J_B17 P230 Micro3 0 DR
J_A14 N132 N153 0 DR
R40 VDD N132 50k
J_F14 VDD N132 P232 DR
R41 P232 PC_Jin_Loading 1k
R42 PC_Jin_Loading VSS 4.5k
J_A17 N221 JIN P233 DR
R49 VDD N221 100k
J_F17 VDD N221 P234 DR
R50 P234 N238 1k
R51 N238 VSS 4.8k
J_B22 P233 Micro4 0 DR
J_A18 N228 N238 0 DR
R52 VDD N228 50k
J_F18 VDD N228 P235 DR
R53 P235 N249 1k
R54 N249 VSS 4.5k
J_Input273 Micro_Reset N249 0 DR
J_B18 P035 Micro2 0 DR
J_B19 P059 Micro2 0 DR
J_Input37 ScratchPadWord1 N174 0 DR
J_Input14 Scratch_Reg_Select N208 0 DR
J_Input25 Scratch_Reg_Select N214 0 DR
J_Input42 Scratch_Reg_Select N217 0 DR
J_Input48 Scratch_Reg_Select N218 0 DR
J_Input54 Scratch_Reg_Select N293 0 DR
J_Input61 Scratch_Reg_Select N219 0 DR
J_B28 P014 Micro3 0 DR
J_Input44 ScratchPadWord2 N258 0 DR
J_Input65 ScratchPad_Load N282 0 DR
J_Input85 INC_Out N282 0 DR
J_B29 P062 Micro3 0 DR
J_Input86 Scratch_Reg_Select N281 0 DR
J_Input87 Scratch_Reg_Select N282 0 DR
J_Input89 Shift_Enable N112 0 DR
J_Input90 Temp_Load N112 0 DR
J_A28 N149 RAR P236 DR
R82 VDD N149 100k
J_F26 VDD N149 P237 DR
R83 P237 N196 1k
R84 N196 VSS 4.8k
J_B30 P236 Micro3 0 DR
J_A29 N171 N196 0 DR
R85 VDD N171 50k
J_F27 VDD N171 P238 DR
R86 P238 N212 1k
R87 N212 VSS 4.5k
J_Input91 Temp_Out N212 0 DR
J_Input93 Acc_Load N212 0 DR
J_Input111 CFStage1_Load N112 0 DR
J_B32 P038 Micro3 0 DR
J_B33 P176 CF P178 DR
J_Input9 Bus1In N107 0 DR
J_A19 N036 TCS P239 DR
R55 VDD N036 100k
J_F19 VDD N036 P240 DR
R56 P240 N088 1k
R57 N088 VSS 4.8k
J_B34 P241 Micro2 0 DR
J_A20 N060 N088 0 DR
R58 VDD N060 50k
J_F28 VDD N060 P242 DR
R59 P242 N104 1k
R60 N104 VSS 4.5k
J_Input28 Bus3In N104 0 DR
J_Input117 Acc_Load N104 0 DR
J_B35 P239 !CF P241 DR
J_Input118 Bus0In N104 0 DR
J_A30 N304 ADD N312 DR
R88 VDD N304 100k
J_F29 VDD N304 P243 DR
R89 P243 N313 1k
R90 N313 VSS 4.8k
J_B36 N312 Micro5 0 DR
J_A31 N308 N313 0 DR
R91 VDD N308 50k
J_F30 VDD N308 P244 DR
R92 P244 N316 1k
R93 N316 VSS 4.5k
J_A32 N304 SUB N312 DR
J_Input180 CFStage1_Load N291 0 DR
J_B37 P139 CF 0 DR
J_A33 N075 CMC P245 DR
R94 VDD N075 100k
J_F31 VDD N075 P246 DR
R95 P246 N110 1k
R96 N110 VSS 4.8k
J_B38 P245 Micro2 P247 DR
J_A34 N094 N110 0 DR
R97 VDD N094 50k
J_F32 VDD N094 P248 DR
R98 P248 N116 1k
R99 N116 VSS 4.5k
J_Input120 CF_Bus_Load N116 0 DR
J_B39 P247 !CF 0 DR
J_Input121 Bus0In N116 0 DR
J_Input179 CF_Load N206 0 DR
J_Input216 CF_Load N212 0 DR
J_Input92 CF_Load N115 0 DR
J_Input110 CF_Load N116 0 DR
J_Input88 CFStage1_Load N111 0 DR
J_Input221 CF_Bus_Load N113 0 DR
J_Input1 ScratchPad_Load N136 0 DR
J_Input2 ScratchPadWord1 N136 0 DR
J_Input3 ScratchPad_Load N259 0 DR
J_Input4 ScratchPadWord2 N259 0 DR
J_Input5 CF_Bus_Load N108 0 DR
J_Input6 CF_Load N106 0 DR
J_Input7 CF_Bus_Load N106 0 DR
J_Input8 Temp_Load N098 0 DR
J_Input10 Temp_INV N098 0 DR
J_A5 N140 CMA P249 DR
R13 VDD N140 100k
J_F5 VDD N140 P250 DR
R14 P250 N184 1k
R15 N184 VSS 4.8k
J_B1 P249 Micro3 0 DR
J_A6 N157 N184 0 DR
R16 VDD N157 50k
J_F6 VDD N157 P251 DR
R17 P251 N201 1k
R18 N201 VSS 4.5k
J_Input11 Temp_Out N201 0 DR
J_Input13 Acc_Load N201 0 DR
J_Input15 Temp_INV N256 0 DR
J_Input16 CF_Bus_Load N207 0 DR
J_Input18 CF_Load N207 0 DR
J_A7 N001 Micro1 0 DR
R19 VDD N001 50k
J_F7 VDD N001 P252 DR
R20 P252 N003 1k
R21 N003 VSS 4.5k
J_A8 N002 N003 0 DR
R22 VDD N002 50k
J_F8 VDD N002 P253 DR
R23 P253 IR_Load 1k
R24 IR_Load VSS 4.5k
.model NJF NJF
.model PJF PJF
.lib standard.jft
* A
* M
* X1
* X2
* NOP
* X3
* JCN
* FIM
* FIN
* JUN
* JMS
* INC
* ISZ
* XCH
* LD
* BBL
* LDM
* CLB
* CLC
* IAC
* CMA
* CMC
* RAL
* RAR
* TCC
* DAC
* STC
* TCS
* WRM
* RDM
* ADD
* SUB
* JIN
.backanno
.end